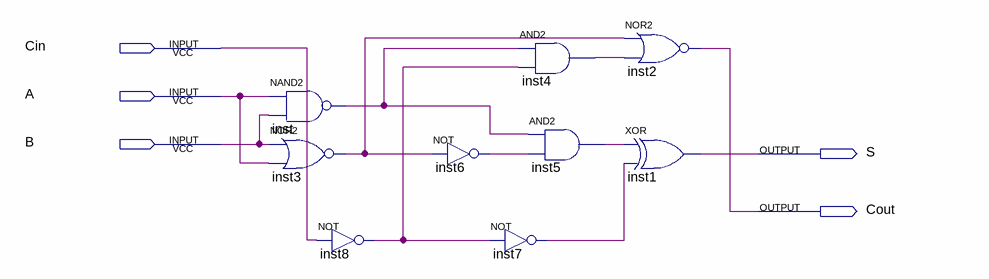
[diagram p0: schematic sheet]
// Quartus schematic SOMA1BIT.bdf as structural Verilog: 9 symbols, 5 pins
module SOMA1BIT (
  input  Cin,
  input  A,
  input  B,
  output S,
  output Cout
);

  wire inst3_out, inst4_out, inst5_out, inst6_out, inst7_out, inst8_out, inst_out;

  nand inst (inst_out, A, B);
  nor inst3 (inst3_out, B, A);
  not inst8 (inst8_out, Cin);
  not inst6 (inst6_out, inst3_out);
  not inst7 (inst7_out, inst8_out);
  and inst4 (inst4_out, inst_out, inst8_out);
  and inst5 (inst5_out, inst_out, inst6_out);
  nor inst2 (Cout, inst3_out, inst4_out);
  xor inst1 (S, inst5_out, inst7_out);
endmodule
